# Altium schematic sheet Tx.SchDoc
size 190 x 127 mm
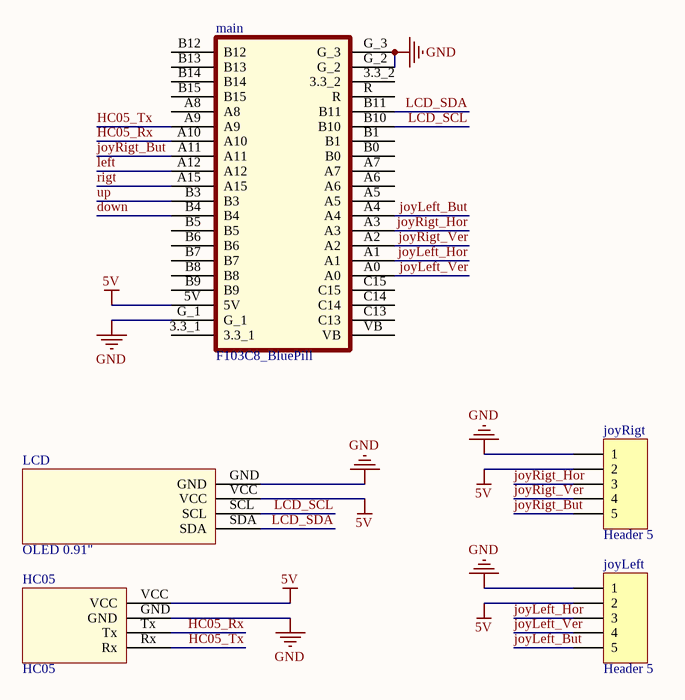
[diagram p0: Tx.SchDoc]

## Parts
HC05  HC05  [HC05]
joyLeft  Header 5  [HDR1X5]
joyRigt  Header 5  [HDR1X5]
LCD  OLED 0.91"  [OLED 0.91"]
main  F103C8_BluePill  [F103_BluePill]

## Nets
5V: HC05.VCC joyLeft.2 joyRigt.2 LCD.VCC main.5V
GND: HC05.GND joyLeft.1 joyRigt.1 LCD.GND main.G_1 main.G_2 main.G_3
down: main.B4
HC05_Rx: HC05.Tx main.A10
HC05_Tx: HC05.Rx main.A9
joyLeft_But: joyLeft.5 main.A4
joyLeft_Hor: joyLeft.3 main.A1
joyLeft_Ver: joyLeft.4 main.A0
joyRigt_But: joyRigt.5 main.A11
joyRigt_Hor: joyRigt.3 main.A3
joyRigt_Ver: joyRigt.4 main.A2
LCD_SCL: LCD.SCL main.B10
LCD_SDA: LCD.SDA main.B11
left: main.A12
rigt: main.A15
up: main.B3

Not connected (* = marked no-connect by the designer): main 3.3_1 3.3_2 A5 A6 A7 A8 B0 B1 B5 B6 B7 B8 B9 B12 B13 B14 B15 C13 C14 C15 R VB

## Library data of the parts
joyLeft joyRigt = Header 5: Header, 5-Pin; LatestRevisionDate: 17-Jul-2002; LatestRevisionNote: Re-released for DXP Platform.; Publisher: Altium Limited